# Altium schematic sheet High-Current Power Supply.SchDoc: High-Current Power Supply
size 228 x 165 mm; DrawnBy: Joseph Riesen; DocumentNumber: 6; Revision: 1.0; SheetNumber: 6; SheetTotal: 10
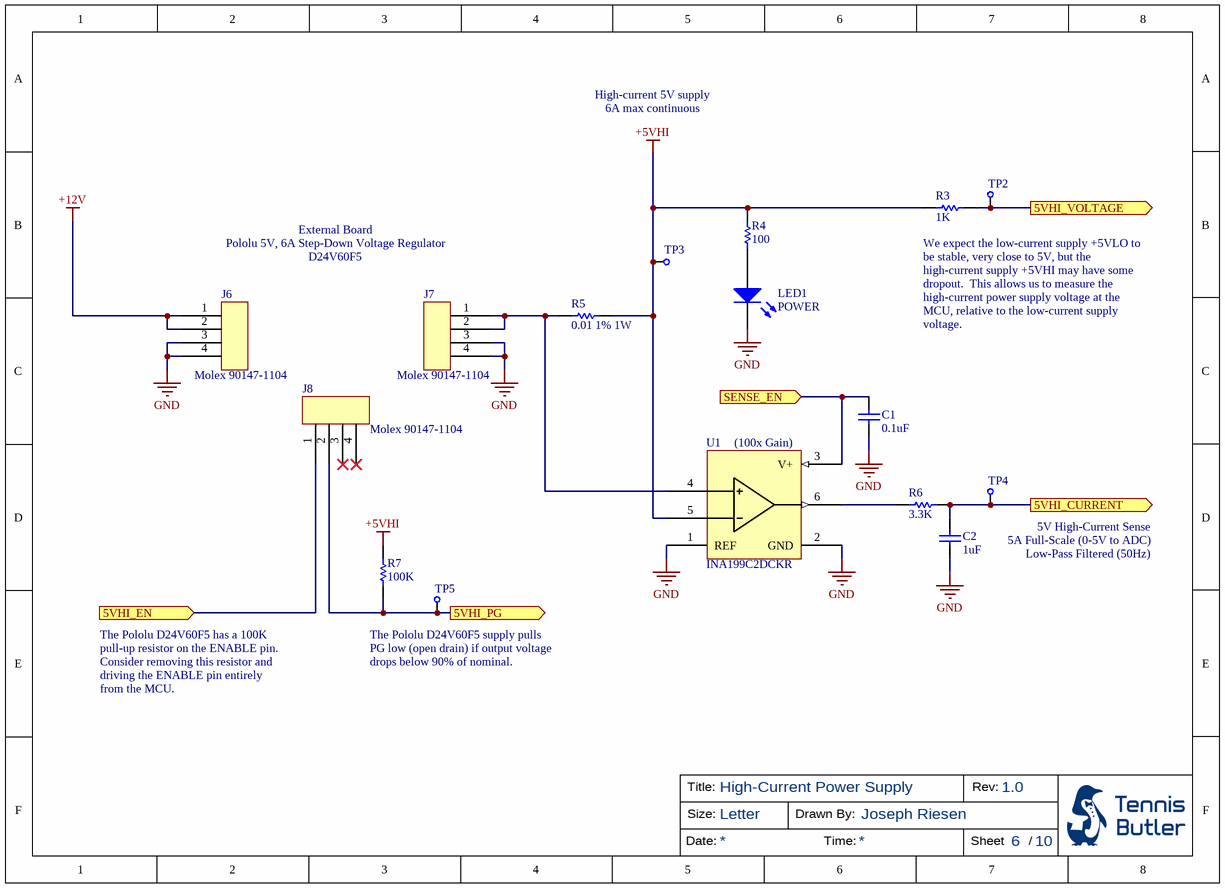
[diagram p0: High-Current Power Supply.SchDoc]

## Parts
C1  0.1uF  [CAPC0805(2012)100_M]
C2  1uF  [CAPC2013X100X50ML20T25]
J6  Molex 90147-1104  [Molex 90147-1104]
J7  Molex 90147-1104  [Molex 90147-1104]
J8  Molex 90147-1104  [Molex 90147-1104]
LED1  POWER  [0805_A]
R3  1K  [RESC2013X70X40ML20T20]
R4  100  [RESC2013X70X40ML20T20]
R5  0.01 1% 1W  [RESC3216X70X50NL05T20]
R6  3.3K  [RESC2013X70X40ML20T20]
R7  100K  [RESC2013X70X40ML20T20]
TP2  5VHI VSENSE  [Test Point]  (value not drawn)  (no BOM)
TP3  +5VHI  [Test Point]  (value not drawn)  (no BOM)
TP4  5VHI CSENSE  [Test Point]  (value not drawn)  (no BOM)
TP5  5VHI PG  [Test Point]  (value not drawn)  (no BOM)
U1  INA199C2DCKR  [TSOP65P240X110-6M]

## Ports
5VHI_CURRENT (out), 5VHI_EN (in), 5VHI_PG (out), 5VHI_VOLTAGE (out), SENSE_EN (in)

## Nets
+5VHI: R3.1 R4.2 R5.2 R7.2 TP3.1 U1.5(IN-)
+12V: J6.1 J6.2
GND: C1.1 C2.1 J6.3 J6.4 J7.3 J7.4 LED1.1(K) U1.1(REF) U1.2(GND)
5VHI_CURRENT: C2.2 R6.2 TP4.1 ; port 5VHI_CURRENT
5VHI_EN: J8.1 ; port 5VHI_EN
5VHI_PG: J8.2 R7.1 TP5.1 ; port 5VHI_PG
5VHI_VOLTAGE: R3.2 TP2.1 ; port 5VHI_VOLTAGE
SENSE_EN: C1.2 U1.3(V+) ; port SENSE_EN
NetJ7_1: J7.1 J7.2 R5.1 U1.4(IN+)
NetLED1_2: LED1.2(A) R4.1
NetR6_1: R6.1 U1.6(OUT)

Not connected (* = marked no-connect by the designer): J8 3* 4*

## Notes on the sheet
- High-current 5V supply
  6A max continuous
- External Board
  Pololu 5V, 6A Step-Down Voltage Regulator
  D24V60F5
- We expect the low-current supply +5VLO to be stable, very close to 5V, but the high-current supply +5VHI may have some dropout.  This allows us to measure the high-current power supply voltage at the MCU, relative to the low-current supply voltage.
- (near U1) (100x Gain)
- 5V High-Current Sense
  5A Full-Scale (0-5V to ADC)
  Low-Pass Filtered (50Hz)
- The Pololu D24V60F5 has a 100K pull-up resistor on the ENABLE pin.  Consider removing this resistor and driving the ENABLE pin entirely from the MCU.
- The Pololu D24V60F5 supply pulls PG low (open drain) if output voltage drops below 90% of nominal.
- Title:
- Size:
- Letter
- Drawn By:
- Rev:
- Date:
- Time:
- Sheet
- /

## Library data of the parts
C1 = CMP-1036-04391-1: CAP 100nF 6.3V ±10% 0805 (2012 Metric) Thickness 1mm SMD; Case-EIA: 0805; Case-Metric: 2012; Tolerance: Â±10%; Rated Voltage: 6.3 V; Technology: SMT; Value: 100nF; Max Thickness: 1 mm
C2 = CMP-2007-03677-1: Manufacturer: Kemet; Part Number: C0805C105K9RACTU
J6-J8 = Molex 90147-1104 C-Grid 4-Pin Header: C-Grid® PC Board Connector, Single Row, Vertical, 4 Circuits, Tin (Sn) Plating; Number of Positions: 4; Current Rating: 3A; Voltage Rating: 350V; Gender: Female; Pitch: 2.54mm; Glow Wire Compliant: Non-compliant; Supplier 1: Digi-Key; Manufacturer: Molex; Manufacturer Part Number: 90147-1104; Stock 1: 11420; Pricing 1: 1 = 1.24000, 10 = 1.08800, 100 = 0.93830, 500 = 0.76770, 4160 = 0.61843, 8320 = 0.56725, 12480 = 0.55445 (USD); RoHS 1: Yes; Contact Plating: Tin; Contact Material: Bronze; Housing Material: Polyester; Material: Bronze; Number of Rows: 1; Package Quantity: 4160; Packaging: Rail/Tube; Termination: Through Hole; Number of Contacts: 4; Orientation: Vertical; Number of Circuits: 4; Radiation Hardening: No; REACH SVHC: Unknown; Flammability Rating: UL94 V-0; ComponentLink1URL: https://datasheet.ciiva.com/13565/0901471104-pcb-receptacles-176839-13565807.pdf?src-supplier=Mouser; ComponentLink1Description: Datasheet 1 (Mouser); ComponentLink2URL: https://datasheet.ciiva.com/46431/1597377-46431813.pdf?src-supplier=Element14; ComponentLink2Description: Datasheet 2 (Element14); ComponentLink3URL: https://datasheet.ciiva.com/16733/0901471104-pcb-receptacles-16733373.pdf?src-supplier=Avnet+Europe; ComponentLink3Description: Datasheet 3 (Avnet Europe); ComponentLink4URL: https://datasheet.ciiva.com/10088/0901471104-pcb-receptacles-10088734.pdf?src-supplier=Avnet; ComponentLink4Description: Datasheet 4 (Avnet); ComponentLink5URL: https://datasheet.ciiva.com/16733/0901471104-pcb-receptacles-16733374.pdf?src-supplier=Avnet+Europe; ComponentLink5Description: Datasheet 5 (Avnet Europe); Supplier Part Number 1: WM14831-ND
LED1 = CMP-1426-00008-1: SMD mono-color Chip LED, WL-SMCW, Blue; Manufacturer: Wuerth Elektronik; PartNumber: 150080BS75000; Color: Blue; ComponentLink2URL: http://katalog.we-online.com/led/datasheet/150080BS75000.pdf; ComponentLink1URL: http://www.we-online.com; ComponentLink2Description: Datasheet; PackageReference: 0805_A; ComponentLink1Description: Manufacturer URL
R3 = CMP-2001-04375-1: RES SMD 1K OHM 1% 1/8W 0805; Part Number: ERJ-6ENF1001V; Manufacturer: Panasonic
R4 = CMP-1665-00009-4: Chip Resistor, 100 Ohm, +/- 1%, 0.125 W, -55 to 155 degC, 0805 (2012 Metric), RoHS, Tape and Reel; Manufacturer: Panasonic; Voltage Rating: 150 V; Height: 0.6 mm; RoHSCompliant: true; Min Operating Temperature: -55 degC; REACH SVHC: Yes; Package Quantity: 5000; ComponentLink2Description: Datasheet; ComponentLink1URL: http://www.panasonic.com/; Mount: Surface Mount; Max Operating Temperature: 155 degC; ComponentLink1Description: Manufacturer URL; Mounting Technology: Surface Mount; PackageReference: 0805; DatasheetVersion: 04/2015; Pins: 2; Length: 2 mm; Packaging: Tape and Reel; ComponentLink2URL: http://industrial.panasonic.com/cdbs/www-data/pdf/RDA0000/AOA0000C86.pdf; PackageDescription: 2-Pin Surface Mount Device, Body 2 x 1.25 mm
R5 = CMP-2003-00786-1: Part Number: ERJ8CWFR010V; Manufacturer: Panasonic
R6 = CMP-2001-00533-1: RES SMD 3.3K OHM 1% 1/8W 0805; Manufacturer: Panasonic; Part Number: ERJ6ENF3301V
R7 = CMP-2001-04377-1: RES SMD 100K OHM 1% 1/8W 0805; Part Number: ERJ-6ENF1003V; Manufacturer: Panasonic
TP2-TP5 = Test Point
U1 = INA199C2DCKR: IC OP AMP CURR SENSE SC70-6; Manufacturer: Texas Instruments; Supplier 1: Digi-Key; Manufacturer Part Number: INA199C2DCKR; Stock 1: 3000; Pricing 1: 1 = 0.90000, 10 = 0.80200, 100 = 0.62540, 500 = 0.51664, 1000 = 0.40788 (USD); RoHS 1: No; Min Operating Temperature: -40°C; Max Operating Temperature: 125°C; ComponentLink1URL: http://www.ti.com/lit/pdf/slyb194?src-supplier=Digi-Key; ComponentLink1Description: http://www.ti.com/lit/pdf/slyb194?src-supplier=Digi-Key; Supplier Part Number 1: 296-49644-1-ND